# EAGLE design MCU_V4 (EAGLE 7.6.0)
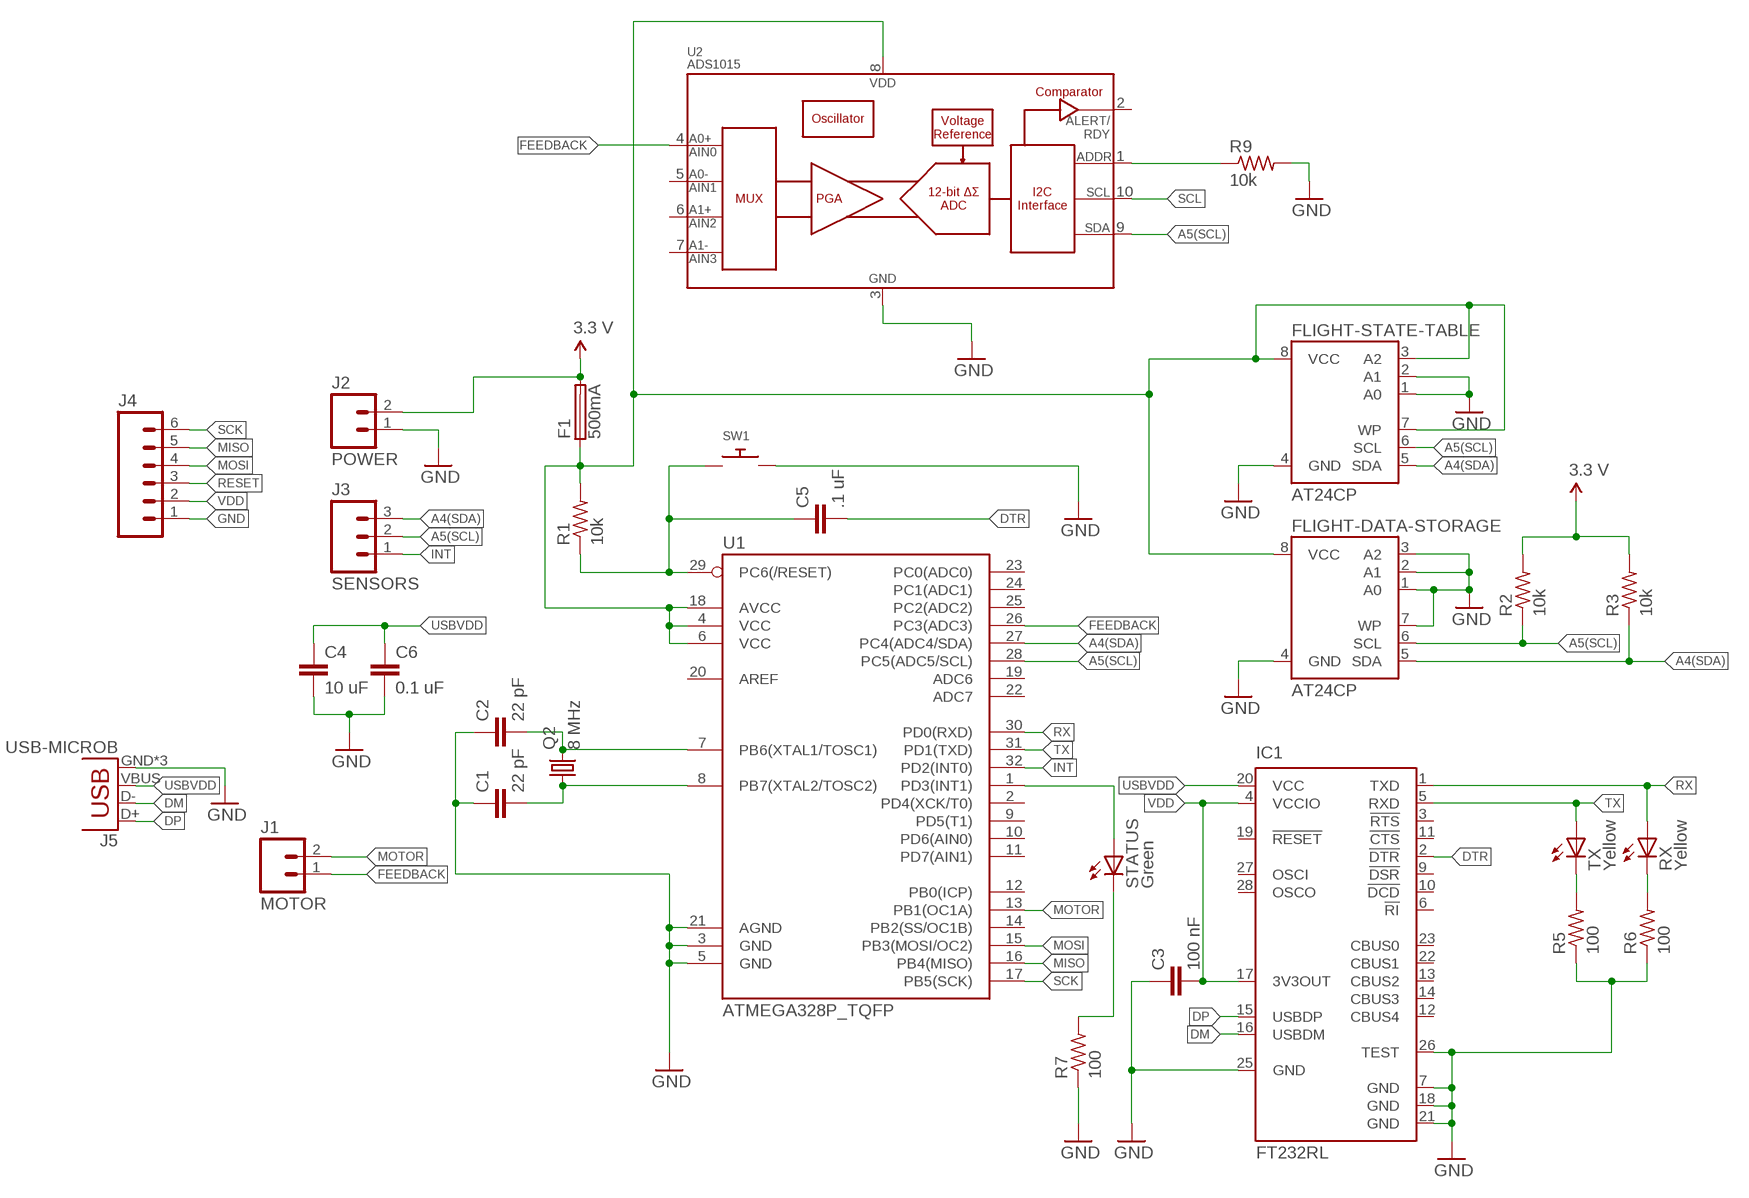
[diagram p0: schematic, sheet 1]

## Parts
C1  22 pF  CC1206  [C1206]
C2  22 pF  CC1206  [C1206]
C3  100 nF  CC1206  [C1206]
C4  10 uF  CC1206  [C1206]
C5  .1 uF  CC1206  [C1206]
C6  0.1 uF  CC1206  [C1206]
F1  500mA  PICOFUSE  [PICOFUSE]
FLIGHT-DATA-STORAGE  AT24CP  [DIL08]
FLIGHT-STATE-TABLE  AT24CP  [DIL08]
IC1  FT232RL  [SSOP28]
J1  MOTOR  M02LOCK  [1X02_LOCK]
J2  POWER  M02LOCK  [1X02_LOCK]
J3  SENSORS  M03LOCK  [1X03_LOCK]
J4  M06LOCK  [1X06_LOCK]
J5  USB-MICROB  [USB-MICROB]
Q2  8 MHz  CRYSTALHC49S  [HC49/S]
R1  10k  R-US_R1206  [R1206]
R2  10k  R-US_R1206  [R1206]
R3  10k  R-US_R1206  [R1206]
R5  100  R-US_R1206  [R1206]
R6  100  R-US_R1206  [R1206]
R7  100  R-US_R1206  [R1206]
R9  10k  R-US_R1206  [R1206]
RX  Yellow  LEDCHIPLED_1206  [CHIPLED_1206]
STATUS  Green  LEDCHIPLED_1206  [CHIPLED_1206]
SW1  SWITCH_PUSHBUTTONSOFTTOUCHSMD_SJ  [PUSHBUTTON_SMD_SJ]
TX  Yellow  LEDCHIPLED_1206  [CHIPLED_1206]
U1  ATMEGA328P_TQFP  [TQFP32-08]
U2  ADS1015  [MSOP10]

## Nets
A4(SDA): FLIGHT-DATA-STORAGE.5(SDA) FLIGHT-STATE-TABLE.5(SDA) J3.3 R3.1 R9.1 U1.27(PC4(ADC4/SDA)) U2.1(ADDR)
A5(SCL): FLIGHT-DATA-STORAGE.6(SCL) FLIGHT-STATE-TABLE.6(SCL) J3.2 R2.1 U1.28(PC5(ADC5/SCL)) U2.9(SDA)
DM: IC1.16(USBDM) J5.D-
DP: IC1.15(USBDP) J5.D+
DTR: C5.2 IC1.2(!DTR)
FEEDBACK: J1.1 U1.26(PC3(ADC3)) U2.4(AIN0)
GND: C1.1 C2.1 C3.1 C4.2 C6.2 FLIGHT-DATA-STORAGE.1(A0) FLIGHT-DATA-STORAGE.2(A1) FLIGHT-DATA-STORAGE.3(A2) FLIGHT-DATA-STORAGE.4(GND) FLIGHT-DATA-STORAGE.7(WP) FLIGHT-STATE-TABLE.1(A0) FLIGHT-STATE-TABLE.2(A1) FLIGHT-STATE-TABLE.4(GND) IC1.7(GND) IC1.18(GND) IC1.21(GND) IC1.25(GND) IC1.26(TEST) J2.1 J4.1 J5.GND J5.MT1(GND) J5.MT2(GND) R5.1 R6.1 R7.1 R9.2 SW1.P$2 U1.3(GND) U1.5(GND) U1.21(AGND) U2.3(VSS)
INT: J3.1 U1.32(PD2(INT0))
MISO: J4.5 U1.16(PB4(MISO))
MOSI: J4.4 U1.15(PB3(MOSI/OC2))
MOTOR: J1.2 U1.13(PB1(OC1A))
N$1: F1.1 FLIGHT-DATA-STORAGE.8(VCC) FLIGHT-STATE-TABLE.3(A2) FLIGHT-STATE-TABLE.7(WP) FLIGHT-STATE-TABLE.8(VCC) R1.2 U1.4(VCC) U1.6(VCC) U1.18(AVCC) U2.8(VDD)
N$2: C2.2 Q2.2 U1.7(PB6(XTAL1/TOSC1))
N$3: C1.2 Q2.1 U1.8(PB7(XTAL2/TOSC2))
N$4: STATUS.A U1.1(PD3(INT1))
N$8: R7.2 STATUS.C
N$9: R5.2 TX.C
N$10: R6.2 RX.C
RESET: C5.1 J4.3 R1.1 SW1.P$1 U1.29(PC6(/RESET))
RX: IC1.1(TXD) RX.A U1.30(PD0(RXD))
SCK: J4.6 U1.17(PB5(SCK))
SCL: U2.10(SCL)
TX: IC1.5(RXD) TX.A U1.31(PD1(TXD))
USBVDD: C4.1 C6.1 IC1.20(VCC) J5.VBUS
VDD: C3.2 F1.2 IC1.4(VCCIO) IC1.17(3V3OUT) J2.2 J4.2 R2.2 R3.2 ; supply symbol labelled 3.3 V
Unconnected: IC1.3(!RTS) IC1.6(!RI) IC1.9(!DSR) IC1.10(!DCD) IC1.11(!CTS) IC1.12(CBUS4) IC1.13(CBUS2) IC1.14(CBUS3) IC1.19(!RESET) IC1.22(CBUS1) IC1.23(CBUS0) IC1.27(OSCI) IC1.28(OSCO) U1.2(PD4(XCK/T0)) U1.9(PD5(T1)) U1.10(PD6(AIN0)) U1.11(PD7(AIN1)) U1.12(PB0(ICP)) U1.14(PB2(SS/OC1B)) U1.19(ADC6) U1.20(AREF) U1.22(ADC7) U1.23(PC0(ADC0)) U1.24(PC1(ADC1)) U1.25(PC2(ADC2)) U2.2(ALERT/RDY) U2.5(AIN1) U2.6(AIN2) U2.7(AIN3)

## Library data of the parts
C1-C6 = eagle-ltspice:C: CAPACITOR, European symbol; SPICEMODEL: NONE; SPICEPREFIX: C
F1 = fuse:PICOFUSE: PICOFUSE 19275, Wickmann; OC_FARNELL: unknown; OC_NEWARK: unknown
FLIGHT-DATA-STORAGE FLIGHT-STATE-TABLE = atmel:AT24C*: 2-wire serial EEPROM; MPN: AT24C1024BW-SH-B; OC_FARNELL: 1362646; OC_NEWARK: 03P2044
IC1 = ftdichip:FT232R: Source: http://www.ftdichip.com/Documents/DataSheets/DS_FT232R_v104.pdf; MPN: FT232RL; OC_FARNELL: 1146032; OC_NEWARK: 91K9918
J1 J2 = SparkFun-Connectors:M02: Standard 2-pin 0.1" header. Use with - straight break away headers ( PRT-00116) - right angle break away headers (PRT-00553) - swiss pins (PRT-00743) - machine pins (PRT-00117) - female headers (PRT-00115) Molex polarized connector foot print use with: PRT-08233 with associated crimp pins and housings. 2.54_SCREWTERM for use with PRT-10571. 3.5mm Screw Terminal footprints for PRT-08084 5mm Screw Terminal footprints for use with PRT-08432
J3 = SparkFun-Connectors:M03: Header 3 Standard 3-pin 0.1" header. Use with straight break away headers (SKU : PRT-00116), right angle break away headers (PRT-00553), swiss pins (PRT-00743), machine pins (PRT-00117), and female headers (PRT-00115). Molex polarized connector foot print use with SKU : PRT-08232 with associated crimp pins and housings.
J4 = SparkFun-Connectors:M06: Header 6 Standard 6-pin 0.1" header. Use with straight break away headers (SKU : PRT-00116), right angle break away headers (PRT-00553), swiss pins (PRT-00743), machine pins (PRT-00117), and female headers (PRT-00115). Molex polarized connector foot print use with SKU : PRT-08094 with associated crimp pins and housings. NOTES ON THE VARIANTS LOCK and LOCK_LONGPADS... This footprint was designed to help hold the alignment of a through-hole component (i.e. 6-pin header) while soldering it into place. You may notice that each hole has been shifted either up or down by 0.005 of an inch from it's more standard position (which is a perfectly straight line). This slight alteration caused the pins (the squares in the middle) to touch the edges of the holes. Because they are alternating, it causes a "brace" to hold the component in place. 0.005 has proven to be the perfect amount of "off-center" position when using our standard breakaway headers. Although looks a little odd when you look at the bare footprint, once you have a header in there, the alteration is very hard to notice. Also,if you push a header all the way into place, it is covered up entirely on the bottom side. This idea of altering the position of holes to aid alignment will be further integrated into the Sparkfun Library for other footprints. It can help hold any component with 3 or more connection pins.
J5 = SparkFun-Connectors:USB: USB Connectors USB-B-PTH is fully proven SKU : PRT-00139/CONN-08278 USB-miniB is fully proven SKU : PRT-00587 USB-A-PCB is untested. USB-A-H is throughly reviewed, but untested. Spark Fun Electronics SKU : PRT-00437 USB-B-SMT is throughly reviewed, but untested. Needs silkscreen touching up. USB-A-S has not been used/tested USB-MB-H has not been used/tested USB-MICROB has been used. CONN-09505; PROD_ID: CONN-09505
Q2 = adafruit:CRYSTAL: CRYSTAL; OC_FARNELL: 1667008; OC_NEWARK: unknown
R1-R3 R5-R7 R9 = adafruit:R-US_: RESISTOR, American symbol
RX STATUS TX = adafruit:LED: LED OSRAM: - CHIPLED LG R971, LG N971, LY N971, LG Q971, LY Q971, LO R971, LY R971 LH N974, LH R974 LS Q976, LO Q976, LY Q976 LO Q996 - Hyper CHIPLED LW Q18S LB Q993, LB Q99A, LB R99A - SideLED LS A670, LO A670, LY A670, LG A670, LP A670 LB A673, LV A673, LT A673, LW A673 LH A674 LY A675 LS A676, LA A676, LO A676, LY A676, LW A676 LS A679, LY A679, LG A679 - Hyper Micro SIDELED® LS Y876, LA Y876, LO Y876, LY Y876 LT Y87S - SmartLED LW L88C, LW L88S LB L89C, LB L89S, LG L890 LS L89K, LO L89K, LY L89K LS L896, LA L896, LO L896, LY L896 - TOPLED LS T670, LO T670, LY T670, LG T670, LP T670 LSG T670, LSP T670, LSY T670, LOP T670, LYG T670 LG T671, LOG T671, LSG T671 LB T673, LV T673, LT T673, LW T673 LH T674 LS T676, LA T676, LO T676, LY T676, LB T676, LH T676, LSB T676, LW T676 LB T67C, LV T67C, LT T67C, LS T67K, LO T67K, LY T67K, LW E67C LS E67B, LA E67B, LO E67B, LY E67B, LB E67C, LV E67C, LT E67C LW T67C LS T679, LY T679, LG T679 LS T770, LO T770, LY T770, LG T770, LP T770 LB T773, LV T773, LT T773, LW T773 LH T774 LS E675, LA E675, LY E675, LS T675 LS T776, LA T776, LO T776, LY T776, LB T776 LHGB T686 LT T68C, LB T68C - Hyper Mini TOPLED® LB M676 - Mini TOPLED Santana® LG M470 LS M47K, LO M47K, LY M47K Source: http://www.osram.convergy.de/
SW1 = adafruit:SWITCH_PUSHBUTTON: Buttons SOFTTOUCHSMD_SJ - Soft touch temporary push button (Super Junk Akihabara) Compatible with SKPMANE010 [Mouser: 688-SKPMAN] C&K_KSS = Digikey: KSS221GLFS
U1 = SparkFun-DigitalIC:ATMEGA328P_TQFP; PROD_ID: IC-09069
U2 = SparkFun-AnalogIC:ADS1015: 12-Bit Del-Sig ADC Four single-ended inputs or two differential inputs Internal PGA I2C interface 2.0-5.5V; PROD_ID: IC-12239

## Board
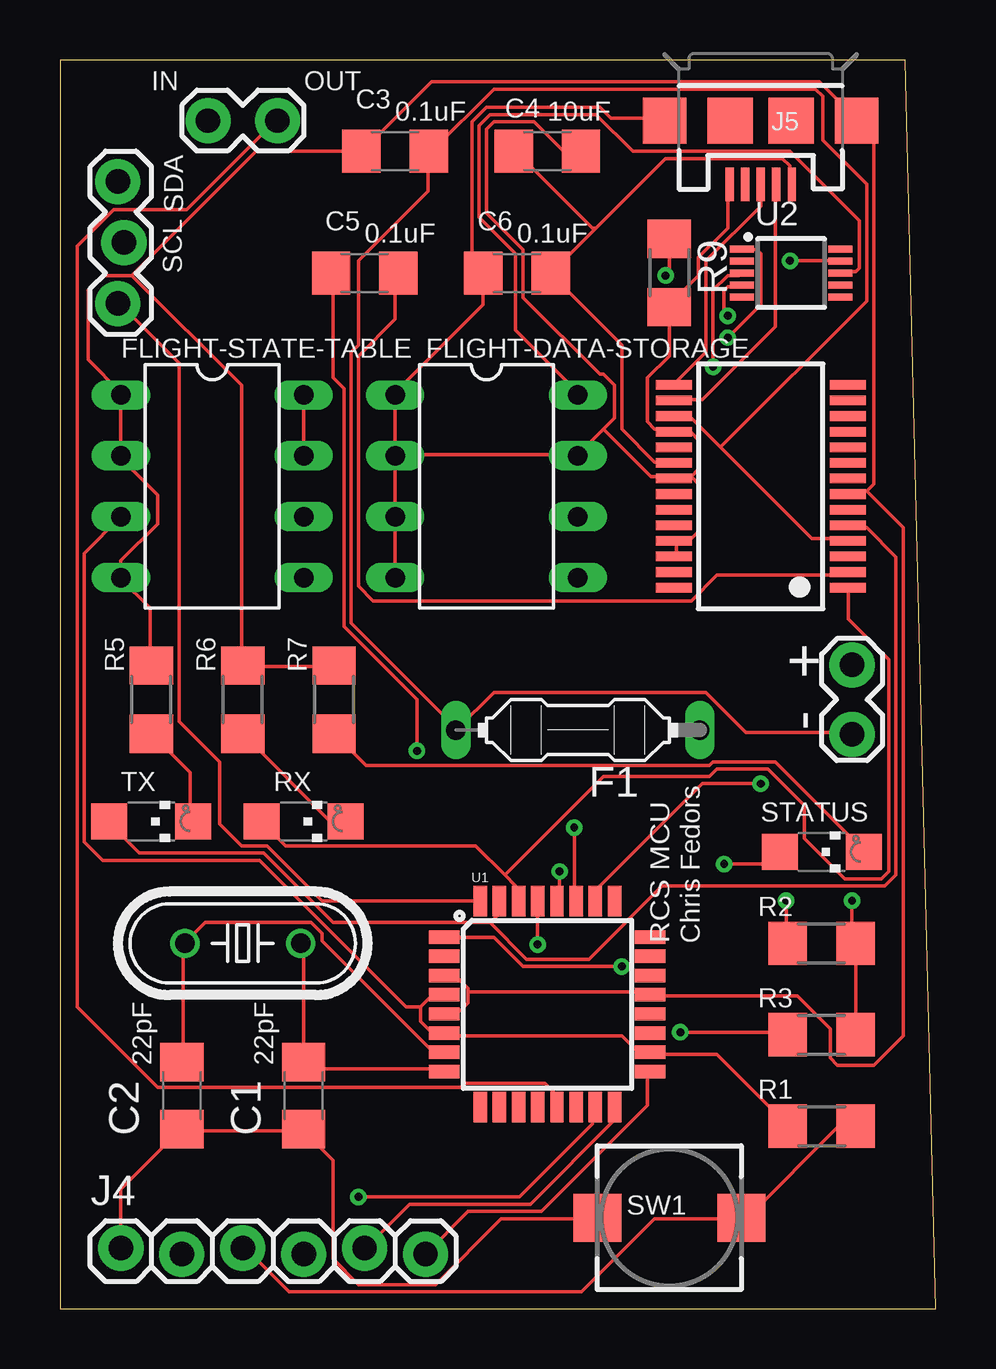
[diagram p1: board, top side]
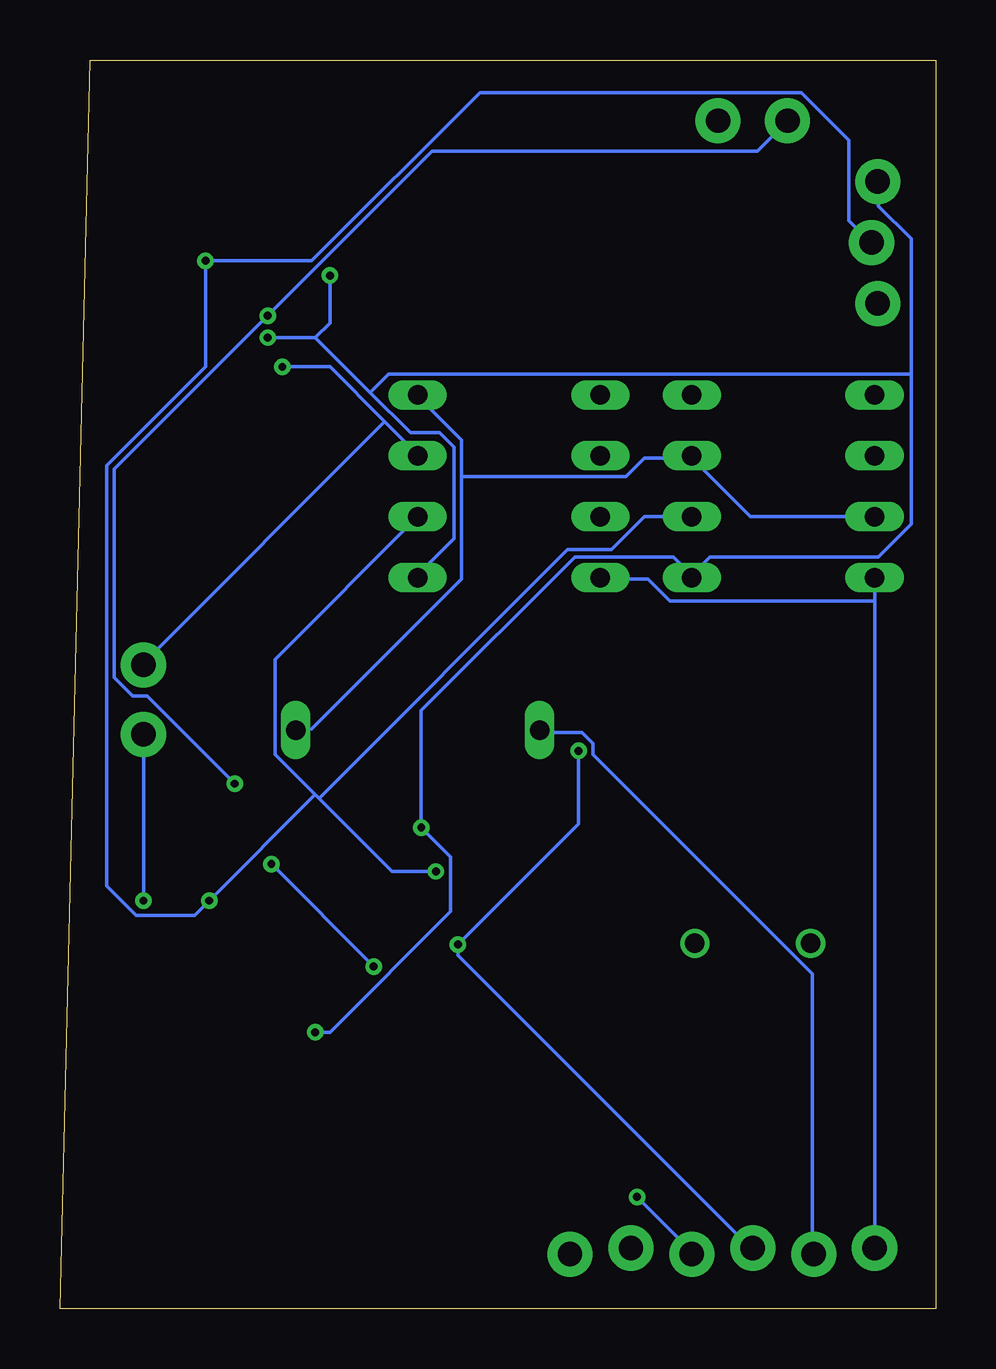
[diagram p2: board, bottom side, seen from below]

Size 36.5 x 52.06 mm. Coordinates in mm from the lower left corner, seen from the top.
Outline: 0,0 36.5,0 35.23,52.06 0,52.06 0,0
Copper layers (1*16): Top 0.0356mm / dielectric 1.5011mm / Bottom 0.0356mm
Design rules "LaenPCBOrder": minimum track width 6mil, minimum drill 13mil, track to track 6mil, track to pad 6mil, pad to pad 6mil, via to via 6mil, smd to smd 6mil, copper to edge 15mil, drill to drill 6mil, minimum pad ring 7mil, minimum via ring 7mil, stop-mask expansion 3mil, vias tented up to drill 0mil, thermal gap 10mil

### Footprints (pad centres in the part's own frame; a part is rotated, then mirrored left to right if it is on the bottom)
C1206 = smd 1.6 x 1.8: 1 -1.4,0; 2 1.4,0
PICOFUSE = drill 0.813 long: 1 -5.08,0; 2 5.08,0
DIL08 = drill 0.813 long: 1 -3.81,-3.81; 2 -1.27,-3.81; 3 1.27,-3.81; 4 3.81,-3.81; 5 3.81,3.81; 6 1.27,3.81; 7 -1.27,3.81; 8 -3.81,3.81
SSOP28 = smd 0.4 x 1.5: 1 -4.225,-3.625; 2 -3.575,-3.625; 3 -2.925,-3.625; 4 -2.275,-3.625; 5 -1.625,-3.625; 6 -0.975,-3.625; 7 -0.325,-3.625; 8 0.325,-3.625; 9 0.975,-3.625; 10 1.625,-3.625; 11 2.275,-3.625; 12 2.925,-3.625; 13 3.575,-3.625; 14 4.225,-3.625; 15 4.225,3.625; 16 3.575,3.625; 17 2.925,3.625; 18 2.275,3.625; 19 1.625,3.625; 20 0.975,3.625; 21 0.325,3.625; 22 -0.325,3.625; 23 -0.975,3.625; 24 -1.625,3.625; 25 -2.275,3.625; 26 -2.925,3.625; 27 -3.575,3.625; 28 -4.225,3.625
1X02_LOCK = drill 1.016 pad 1.88: 1 -0.178,0; 2 2.718,0
1X03_LOCK = drill 1.016 pad 1.88: 1 0,0.127; 2 2.54,-0.127; 3 5.08,0.127
1X06_LOCK = drill 1.016 pad 1.88: 1 0,0; 2 2.54,-0.254; 3 5.08,0; 4 7.62,-0.254; 5 10.16,0; 6 12.7,-0.254
USB-MICROB = smd 0.35 x 1.4: D+ 0,2.65; D- -0.65,2.65; GND 1.3,2.65; ID 0.65,2.65; VBUS -1.3,2.65 | smd 1.8 x 1.9: MT1 -4,0; MT2 4,0 | smd 1.9 x 1.9: P$1 -1.27,0; P$2 1.27,0
HC49/S = drill 0.813: 1 -2.413,0; 2 2.413,0
R1206 = smd 1.6 x 1.803: 1 -1.422,0; 2 1.422,0
CHIPLED_1206 = smd 1.5 x 1.5: A 0,-1.75; C 0,1.75
PUSHBUTTON_SMD_SJ = smd 2 x 2: P$1 3,0; P$2 -3,0
TQFP32-08 = smd 1.27 x 0.559: 1 -4.293,2.8; 2 -4.293,2; 3 -4.293,1.2; 4 -4.293,0.4; 5 -4.293,-0.4; 6 -4.293,-1.2; 7 -4.293,-2; 8 -4.293,-2.8; 17 4.293,-2.8; 18 4.293,-2; 19 4.293,-1.2; 20 4.293,-0.4; 21 4.293,0.4; 22 4.293,1.2; 23 4.293,2; 24 4.293,2.8 | smd 0.559 x 1.27: 9 -2.8,-4.293; 10 -2,-4.293; 11 -1.2,-4.293; 12 -0.4,-4.293; 13 0.4,-4.293; 14 1.2,-4.293; 15 2,-4.293; 16 2.8,-4.293; 25 2.8,4.293; 26 2,4.293; 27 1.2,4.293; 28 0.4,4.293; 29 -0.4,4.293; 30 -1.2,4.293; 31 -2,4.293; 32 -2.8,4.293
MSOP10 = smd 0.3 x 1: 1 -1,-2.05; 2 -0.5,-2.05; 3 0,-2.05; 4 0.5,-2.05; 5 1,-2.05; 6 1,2.05; 7 0.5,2.05; 8 0,2.05; 9 -0.5,2.05; 10 -1,2.05

### Placement (x,y rotation side)
C1  10.16,8.89 90 top
C2  5.08,8.89 90 top
C3  13.97,48.26 0 top
C4  20.32,48.26 0 top
C5  12.7,43.18 0 top
C6  19.05,43.18 180 top
F1  21.59,24.13 180 top
FLIGHT-DATA-STORAGE  17.78,34.29 270 top
FLIGHT-STATE-TABLE  6.35,34.29 270 top
IC1  29.21,34.29 90 top
J1  6.35,49.53 0 top
J2  33.02,26.67 270 top
J3  2.54,41.91 90 top
J4  2.54,2.54 0 top
J5  29.21,49.53 180 top
Q2  7.62,15.24 180 top
R1  31.75,7.62 180 top
R2  31.75,15.24 0 top
R3  31.75,11.43 0 top
R5  3.81,25.4 270 top
R6  7.62,25.4 270 top
R7  11.43,25.4 270 top
R9  25.4,43.18 270 top
RX  10.16,20.32 270 top
STATUS  31.75,19.05 270 top
SW1  25.4,3.81 0 top
TX  3.81,20.32 270 top
U1  20.32,12.7 0 top
U2  30.48,43.18 270 top

### Tracks (layer width: path | path; a pad name or v marks a point on that pad's centre or on a via)
A4(SDA)  (via drill 0.33)
  Top 0.152: v27.84,40.49 29.21,41.86 29.21,43.99 29.06,44.15 28.45,44.15 U2.1 | R9.1 25.4,43.23 v25.25,43.08 | v21.44,20.07 21.44,17.02 U1.27 | v25.86,11.53 30.28,11.53 R3.1
  Bottom 0.152: 25.86,40.49 v27.84,40.49 | 23.57,38.2 21.89,36.52 20.68,36.52 20.07,35.92 20.07,32.11 21.59,30.58 FLIGHT-DATA-STORAGE.5 | 23.57,38.2 25.86,40.49 | v25.25,43.08 25.25,41.1 25.86,40.49 | 10.16,30.58 10.92,31.34 15.04,31.34 21.44,24.94 v21.44,20.07 20.22,18.85 20.22,16.56 25.25,11.53 v25.86,11.53 | 1.02,38.96 1.02,32.71 2.39,31.34 9.4,31.34 10.16,30.58 | 1.02,38.96 1.02,44.6 2.39,45.97 2.39,46.89 J3.3 | 10.16,30.58 FLIGHT-STATE-TABLE.5 | 23.57,38.2 22.81,38.96 1.02,38.96
A5(SCL)  (via drill 0.33)
  Top 0.152: v30.43,43.69 32.41,43.69 U2.9 | v20.83,18.24 20.83,17.02 U1.28 | v30.28,17.02 30.28,15.34 R2.1
  Bottom 0.152: J3.2 2.69,44.45 3.61,45.36 3.61,48.72 5.59,50.7 19,50.7 26.01,43.69 v30.43,43.69 30.43,39.27 34.54,35.15 34.54,17.63 33.33,16.41 30.89,16.41 v30.28,17.02 25.86,21.44 | v20.83,18.24 22.66,18.24 25.71,21.28 | 25.86,21.44 27.53,23.11 27.53,27.08 FLIGHT-DATA-STORAGE.6 | 25.86,21.44 25.71,21.28 | FLIGHT-STATE-TABLE.6 12.14,33.02 13.51,31.65 15.34,31.65 25.71,21.28
DM
  Top 0.152: J5.D- 29.82,46.74 29.82,40.95 26.77,37.9 25.71,37.9 IC1.16
DP
  Top 0.152: J5.D+ 29.21,45.97 26.92,43.69 26.92,39.88 25.71,38.66 IC1.15
DTR
  Top 0.152: IC1.2 32.72,30.58 27.38,30.58 26.31,29.52 13.06,29.52 12.45,30.12 12.45,39.73 13.97,41.25 13.97,43.08 C5.2
FEEDBACK  (via drill 0.33)
  Top 0.152: v27.84,41.4 27.69,41.55 27.69,42.47 27.84,42.62 28.3,42.62 U2.4 | v29.21,21.9 26.77,21.9 22.35,17.48 22.35,17.02 U1.26
  Bottom 0.152: J1.1 6.2,49.48 7.42,48.26 20.98,48.26 v27.84,41.4 34.24,35 34.24,26.31 33.48,25.55 32.87,25.55 v29.21,21.9
GND  (via drill 0.33)
  Top 0.152: 17.02,13.21 17.02,13.36 16.56,13.82 16.1,13.82 U1.3 | 17.02,13.21 17.02,12.75 16.71,12.45 16.1,12.45 U1.5 | 17.02,13.21 24.49,13.21 U1.21 24.64,13.06 30.73,13.06 32.11,11.68 32.11,10.46 32.41,10.16 33.93,10.16 35.15,11.38 35.15,32.56 33.63,34.09 | 33.63,34.09 32.87,34.09 IC1.7 | 33.63,34.09 33.93,34.39 33.93,48.87 33.33,49.48 J5.MT1 33.17,49.63 31.65,51.16 15.49,51.16 12.6,48.26 C3.1 8.18,48.26 3,43.08 | FLIGHT-DATA-STORAGE.4 FLIGHT-DATA-STORAGE.3 FLIGHT-DATA-STORAGE.2 13.97,35.61 | J5.MT2 25.1,49.63 22.96,49.63 22.5,50.09 17.78,50.09 17.17,49.48 17.17,43.69 17.63,43.23 C6.2 17.63,43.08 17.63,41.86 13.97,38.2 FLIGHT-DATA-STORAGE.1 13.97,35.61 | J5.GND 27.84,46.74 27.84,45.06 26.62,43.84 26.62,43.08 25.4,41.86 R9.2 25.4,39.73 24.49,38.81 24.49,36.98 24.79,36.68 25.55,36.68 IC1.18 25.71,36.52 26.31,36.52 26.62,36.22 26.62,35 26.31,34.7 | IC1.26 25.71,31.5 25.71,31.95 IC1.25 25.71,32.11 26.31,32.11 26.62,32.41 26.62,34.39 26.31,34.7 | 26.31,34.7 25.71,34.7 IC1.21 | 26.31,34.7 IC1.21 | v27.23,39.27 27.23,42.47 27.84,43.08 28.3,43.08 U2.3 | C4.2 20.98,48.26 19.76,49.48 18.09,49.48 17.78,49.17 17.78,45.67 19.3,44.15 19.3,42.16 22.5,38.96 22.66,38.96 23.11,38.51 23.11,37.13 22.66,36.68 | 21.59,35.61 22.66,36.68 | 22.66,36.68 24.64,34.7 25.55,34.7 IC1.21 | 21.59,35.61 13.97,35.61 | 21.59,35.61 FLIGHT-DATA-STORAGE.7 | 10.16,7.42 5.13,7.42 C2.1 4.98,7.42 2.54,4.98 J4.1 | 10.16,7.42 11.38,6.2 11.38,2.08 12.45,1.02 15.65,1.02 18.39,3.76 22.35,3.76 SW1.P$2 | 10.16,7.42 C1.1 | R5.1 3.76,26.92 3.76,29.21 2.54,30.43 FLIGHT-STATE-TABLE.4 2.54,31.19 4.06,32.71 4.06,33.93 2.54,35.46 FLIGHT-STATE-TABLE.2 FLIGHT-STATE-TABLE.1 2.54,38.2 1.17,39.57 1.17,42.47 1.78,43.08 3,43.08
  Top 0.152: R7.1 11.38,26.77 7.72,26.77 R6.1 7.57,26.92 7.57,38.51 3,43.08
  Bottom 0.152: v27.23,39.27 25.25,39.27 22.96,36.98 | 22.96,36.98 21.59,35.61 FLIGHT-DATA-STORAGE.7 | 22.96,36.98 33.02,26.92 J2.1 | FLIGHT-STATE-TABLE.4 2.54,29.52 | 2.54,29.52 J4.1 | 2.54,29.52 11.07,29.52 11.99,30.43 13.97,30.43 FLIGHT-DATA-STORAGE.4
INT
  Top 0.152: U1.32 17.48,17.02 10.92,17.02 8.64,19.3 7.57,19.3 6.66,20.22 6.66,22.81 4.98,24.49 4.98,39.42 2.54,41.86 J3.1
MISO
  Top 0.152: U1.16 23.11,8.33 23.11,7.87 19.61,4.37 14.58,4.37 12.75,2.54 J4.5
MOSI  (via drill 0.33)
  Top 0.152: v12.45,4.67 19.15,4.67 22.2,7.72 22.2,8.33 U1.15
  Bottom 0.152: v12.45,4.67 10.16,2.39 J4.4
MOTOR
  Top 0.152: U1.13 20.68,8.48 20.68,8.94 20.22,9.4 16.87,9.4 16.71,9.25 4.06,9.25 0.71,12.6 0.71,44.3 2.24,45.82 5.28,45.82 8.94,49.48 J1.2
N$1
  Top 0.152: 15.04,12.6 15.04,11.99 15.49,11.53 15.95,11.53 U1.6 16.1,11.38 23.42,11.38 24.03,10.77 24.49,10.77 U1.18 24.64,10.62 27.38,10.62 30.28,7.72 R1.2 | 15.04,12.6 15.49,13.06 15.95,13.06 U1.4 | FLIGHT-STATE-TABLE.7 FLIGHT-STATE-TABLE.8 | U2.8 32.56,43.23 33.17,43.23 33.33,43.38 33.33,45.36 30.43,48.26 23.88,48.26 22.35,49.78 17.93,49.78 17.48,49.33 17.48,45.52 19,43.99 19,40.79 21.59,38.2 FLIGHT-DATA-STORAGE.8 | 15.04,12.6 14.43,12.6 8.33,18.69 1.78,18.69 1.02,19.46 1.02,31.5 FLIGHT-STATE-TABLE.3
  Bottom 0.152: FLIGHT-STATE-TABLE.3 7.72,33.02 10.16,35.46 | 19.76,34.7 19.76,36.22 21.59,38.05 FLIGHT-DATA-STORAGE.8 | 19.76,34.7 19.76,30.43 26.01,24.18 26.62,24.18 F1.1 | 10.16,35.46 12.14,35.46 12.9,34.7 19.76,34.7 | 10.16,35.46 FLIGHT-STATE-TABLE.7
N$2
  Top 0.152: U1.7 15.95,10.77 15.49,10.77 10.92,15.34 10.92,15.65 10.46,16.1 6.05,16.1 5.28,15.34 Q2.2 5.13,15.19 5.13,10.31 C2.2
N$3
  Top 0.152: U1.8 15.95,10.01 10.31,10.01 10.16,10.16 C1.2 10.16,15.19 Q2.1
N$4  (via drill 0.33)
  Top 0.152: v23.42,14.27 19.3,14.27 18.09,15.49 16.1,15.49 U1.1 | v27.69,18.54 29.52,18.54 29.97,19 STATUS.A
  Bottom 0.152: v27.69,18.54 v23.42,14.27
N$8
  Top 0.152: STATUS.C 33.48,19.15 29.82,22.81 27.23,22.81 27.08,22.66 12.75,22.66 11.53,23.88 R7.2
N$9
  Top 0.152: TX.C 5.44,20.37 5.44,22.35 3.91,23.88 R5.2
N$10
  Top 0.152: RX.C 11.84,20.37 11.23,20.37 7.72,23.88 R6.2
RESET  (via drill 0.33)
  Top 0.152: R1.1 33.02,7.57 32.41,7.57 28.75,3.91 28.45,3.91 SW1.P$1 28.3,3.76 24.79,3.76 21.74,0.71 9.55,0.71 7.72,2.54 J4.3 | v19.91,15.19 19.91,16.87 U1.29 | v14.88,23.27 14.88,25.4 11.84,28.45 11.84,38.35 11.38,38.81 11.38,43.08 C5.1
  Bottom 0.152: J4.3 7.72,2.54 19.91,14.73 v19.91,15.19 14.88,20.22 v14.88,23.27
RX
  Top 0.152: 18.54,18.09 17.32,19.3 9.4,19.3 8.48,20.22 RX.A | 18.54,18.09 19,17.63 19,17.02 U1.30 | 18.54,18.09 22.66,22.2 27.08,22.2 27.38,22.5 29.52,22.5 31.04,20.98 31.04,19.61 32.72,17.93 34.24,17.93 34.54,18.24 34.54,27.08 32.87,28.75 32.87,29.97 IC1.1
SCK
  Top 0.152: J4.6 17.02,4.06 20.07,4.06 24.49,8.48 24.49,9.86 U1.17
TX
  Top 0.152: 17.93,16.1 18.24,16.41 18.24,16.87 U1.31 | 17.93,16.1 11.38,16.1 8.48,19 3.3,19 2.08,20.22 TX.A | 17.93,16.1 19.46,14.58 22.05,14.58 25.1,17.63 34.39,17.63 34.85,18.09 34.85,31.34 33.63,32.56 32.87,32.56 IC1.5
USBVDD
  Top 0.152: 22.35,45.06 20.52,43.23 C6.1 20.52,43.08 23.42,40.18 23.42,36.68 24.79,35.31 25.55,35.31 IC1.20 | 22.35,45.06 25.25,47.96 30.12,47.96 30.43,47.65 30.43,46.89 J5.VBUS | 22.35,45.06 22.2,45.06 19,48.26 C4.1
VDD  (via drill 0.33)
  Top 0.152: R3.2 33.17,11.53 33.17,15.19 R2.2 33.02,15.34 v33.02,17.02 | 27.53,35.92 26.31,37.13 25.71,37.13 IC1.17 | 27.53,35.92 31.34,32.11 32.72,32.11 IC1.4 | 16.56,24.18 12.14,28.6 12.14,39.88 12.45,40.18 12.45,43.69 15.34,46.58 15.34,48.26 C3.2 15.49,48.26 18.09,50.85 31.5,50.85 31.8,50.55 31.8,48.72 33.63,46.89 33.63,42.01 27.53,35.92 | 16.56,24.18 18.09,25.7 26.92,25.7 28.6,24.03 33.02,24.03 J2.2 | 16.56,24.18 F1.2
  Bottom 0.152: J2.2 v33.02,17.02 | J4.2 5.13,2.39 5.13,13.97 14.28,23.11 14.28,23.57 14.73,24.03 16.41,24.03 F1.2

### Text on the board
tNames: IN | OUT | 0.1uF | 10uF | SDA | 0.1uF | 0.1uF | SCL | + | - | RCS MCU | Chris Fedors | 22pF | 22pF